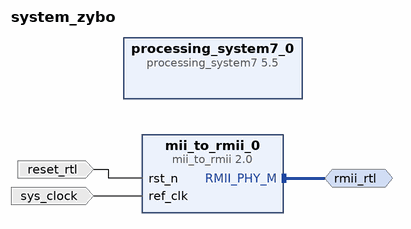
[diagram p0: block diagram of the top level]
# Vivado block design system_zybo, xc7z010clg400-1, Vivado 2016.4
create_bd_design system_zybo

create_bd_intf_port -mode Master -vlnv xilinx.com:interface:rmii_rtl:1.0 rmii_rtl
create_bd_port -dir I -type rst reset_rtl
set_property -dict {CONFIG.POLARITY ACTIVE_LOW} [get_bd_ports reset_rtl]
create_bd_port -dir I -type clk sys_clock
set_property -dict {CONFIG.FREQ_HZ 125000000 CONFIG.PHASE 0.000} [get_bd_ports sys_clock]

create_bd_cell -type ip -vlnv xilinx.com:ip:processing_system7:5.5 processing_system7_0
create_bd_cell -type ip -vlnv xilinx.com:ip:mii_to_rmii:2.0 mii_to_rmii_0
set_property -dict {CONFIG.REF_CLK_BOARD_INTERFACE sys_clock} [get_bd_cells mii_to_rmii_0]

# ---- connections ----

connect_bd_intf_net [get_bd_intf_ports rmii_rtl] [get_bd_intf_pins mii_to_rmii_0/RMII_PHY_M]
connect_bd_net [get_bd_ports reset_rtl] [get_bd_pins mii_to_rmii_0/rst_n]
connect_bd_net [get_bd_ports sys_clock] [get_bd_pins mii_to_rmii_0/ref_clk]

validate_bd_design
save_bd_design
